# EasyEDA Pro project Schematic1.epro

# Schematic Schematic1
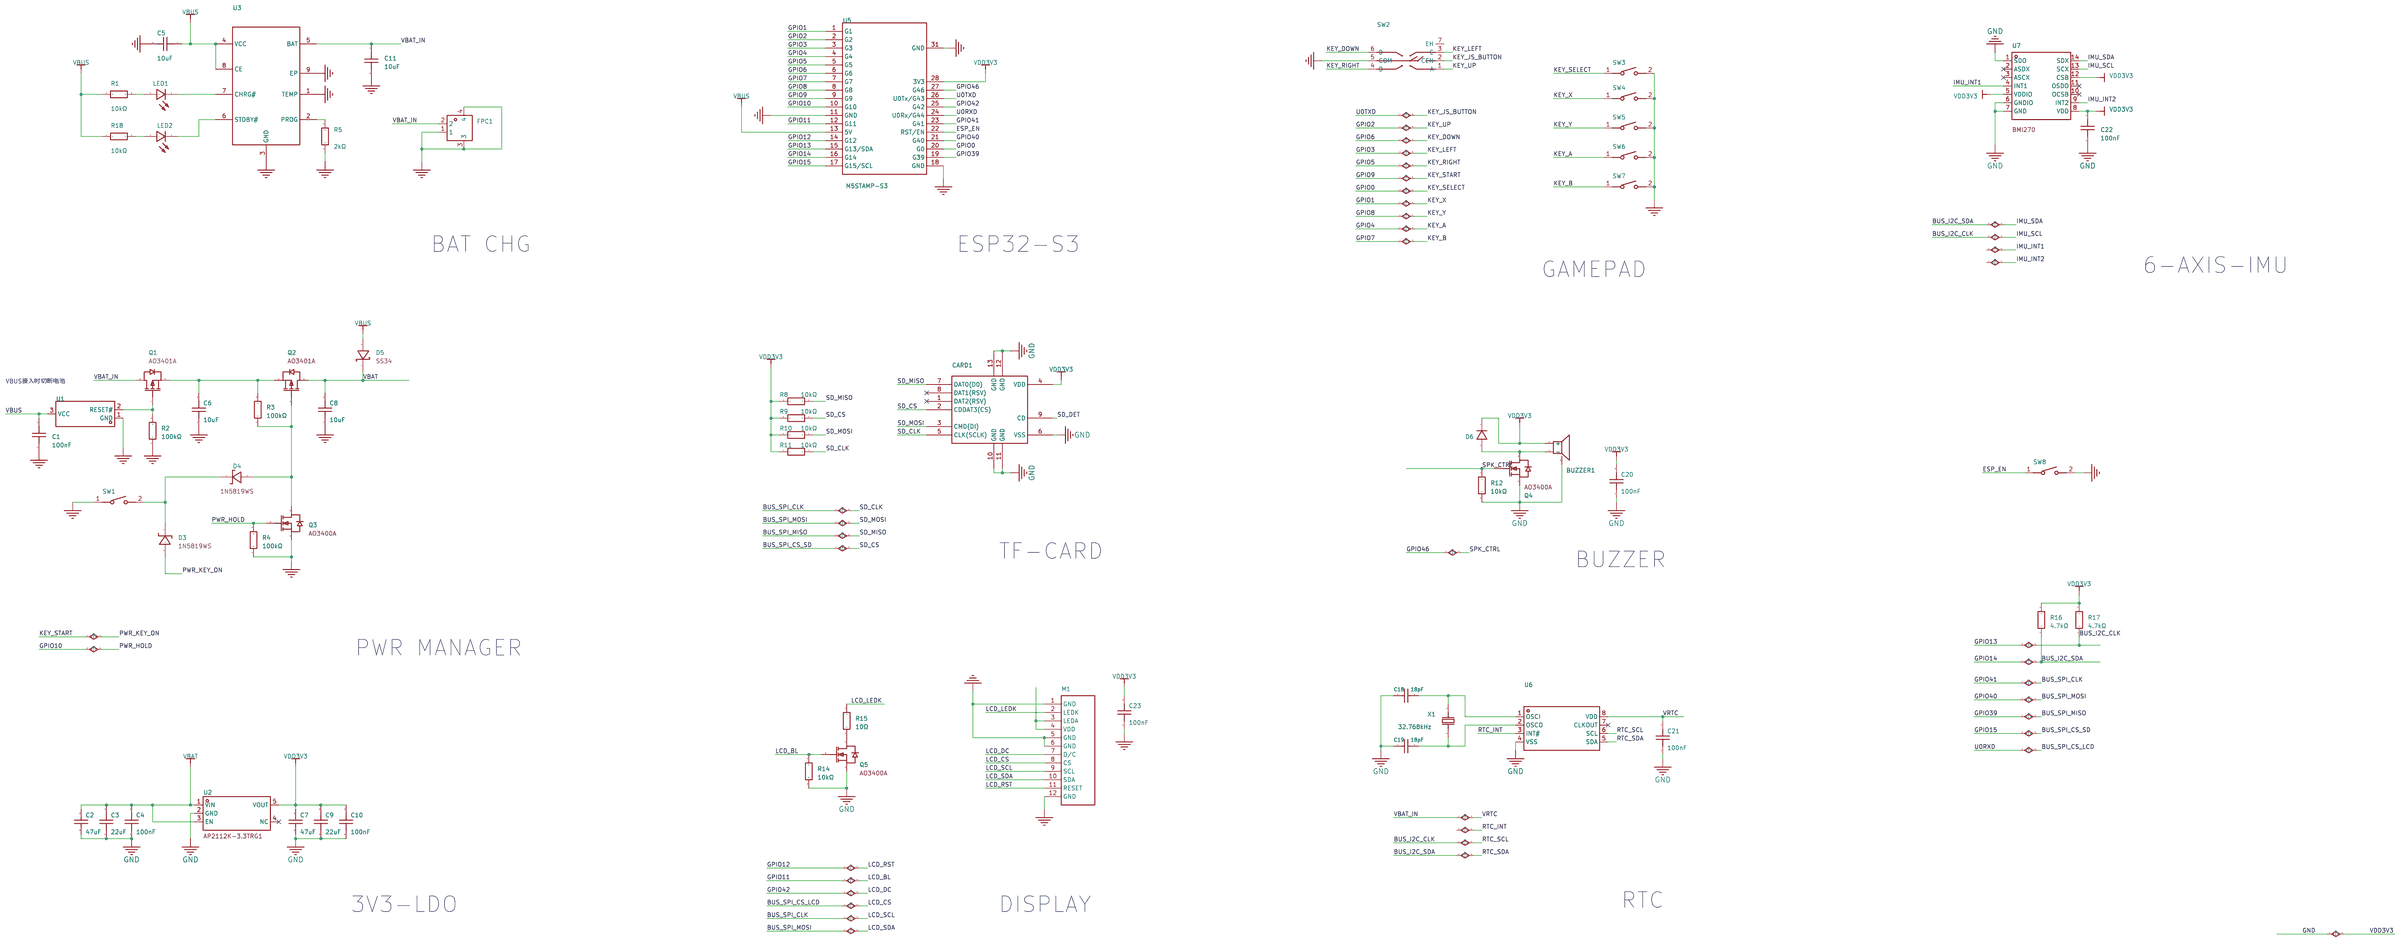
[diagram p0: schematic sheet]

## Parts
BUZZER1  4000Hz  [BUZ-SMD_L5.0-W5.5-P4.60]
C1  100nF  [C0603]
C2  47uF  [C0805]
C3  22uF  [C0805]
C4  100nF  [C0603]
C5  10uF  [C0603]
C6  10uF  [C0603]
C7  47uF  [C0805]
C8  10uF  [C0603]
C9  22uF  [C0805]
C10  100nF  [C0603]
C11  10uF  [C0603]
C18  18pF  [C0603]
C19  18pF  [C0603]
C20  100nF  [C0603]
C21  100nF  [C0603]
C22  100nF  [C0603]
C23  100nF  [C0603]
CARD1  -  [TF-SMD_TF-01A]
D3  1N5819WS  [SOD-323_L1.8-W1.3-LS2.5-RD]
D4  1N5819WS  [SOD-323_L1.8-W1.3-LS2.5-RD]
D5  SS34  [SMA_L4.3-W2.6-LS5.2-RD]
D6  1N4148WS  [SOD-323_L1.8-W1.3-LS2.5-RD]
FPC1  1.25-2PWB  [CONN-SMD_2P-P1.25_DEALON_1.25-2PWB]
LED1  19-213/Y2C-CQ2R2L/3T(CY)  [LED0603-RD-YELLOW]
LED2  19-217/GHC-YR1S2/3T  [LED0603-RD]
M1  1.3寸TFT240*240  [1.3寸TFT240_240]
Q1  AO3401A  [SOT-23_L2.9-W1.3-P1.90-LS2.4-BR]
Q2  AO3401A  [SOT-23_L2.9-W1.3-P1.90-LS2.4-BR]
Q3  AO3400A  [sot-23_l2.9-w1.3-p1.90-ls2.4-br]
Q4  AO3400A  [sot-23_l2.9-w1.3-p1.90-ls2.4-br]
Q5  AO3400A  [sot-23_l2.9-w1.3-p1.90-ls2.4-br]
R1  10kΩ  [R0603]
R2  100kΩ  [R0603]
R3  100kΩ  [R0603]
R4  100kΩ  [R0603]
R5  2kΩ  [R0603]
R8  10kΩ  [R0603]
R9  10kΩ  [R0603]
R10  10kΩ  [R0603]
R11  10kΩ  [R0603]
R12  10kΩ  [R0603]
R14  10kΩ  [R0603]
R15  10Ω  [R0603]
R16  4.7kΩ  [R0603]
R17  4.7kΩ  [R0603]
R18  10kΩ  [R0603]
SW1  TS-1088-AR02016  [SW-SMD_L3.9-W3.0-P4.45]
SW2  TM-4175-B-A  [SW-SMD_TM-4175-B-X]
SW3  TS-1088-AR02016  [SW-SMD_L3.9-W3.0-P4.45]
SW4  TS-1088-AR02016  [SW-SMD_L3.9-W3.0-P4.45]
SW5  TS-1088-AR02016  [SW-SMD_L3.9-W3.0-P4.45]
SW6  TS-1088-AR02016  [SW-SMD_L3.9-W3.0-P4.45]
SW7  TS-1088-AR02016  [SW-SMD_L3.9-W3.0-P4.45]
SW8  TS-1088-AR02016  [SW-SMD_L3.9-W3.0-P4.45]
U1  CN809J  [SOT-23-3_L2.9-W1.3-P1.90-LS2.4-BR]
U2  AP2112K-3.3TRG1  [SOT-25-5_L3.0-W1.8-P0.95-LS3.0-BR]
U3  TP4056-42-ESOP8  [ESOP-8_L4.9-W3.9-P1.27-LS6.0-BL-EP]
U5  M5STAMP-S3  [STAMP-S3-PIN-SMD]
U6  PCF8563T/5,518  [SOIC-8_L5.0-W4.0-P1.27-LS6.0-BL]
U7  BMI270  [LGA-14_L3.0-W2.5-P0.50-BR]
X1  32.768kHz  [FC-135R_L3.2-W1.5]

## Library data of the parts
BUZZER1 = MLT-5020: 驱动方式:无源(外部驱动);构造类型:电磁式;频率:4000Hz;长度:5.2mm;宽度:5.2mm;高度:2.5mm;; Supplier Part: C94598; Manufacturer: 华能; Supplier Footprint: SMD,5x5mm; JLCPCB Part Class: 扩展库; Datasheet: https://atta.szlcsc.com/upload/public/pdf/source/20210811/111454390007D221D7259018FB170E62.pdf; Supplier: LCSC; Oscillator Circuit: 无源(外部驱动); Technology Type: 电磁式; Length: 5.2mm; Width: 5.2mm; Height: 2.5mm
C1 C4 C10 C20-C23 = CC0603KRX7R9BB104: 容值:100nF;精度:±10%;额定电压:50V;材质(温度系数):X7R;; LCSC Part Name: 100nF ±10% 50V; Supplier Part: C14663; Manufacturer: YAGEO(国巨); Supplier Footprint: 0603; JLCPCB Part Class: 基础库; Datasheet: https://atta.szlcsc.com/upload/public/pdf/source/20180910/C282072_33301C7F631E79921B82A8DAC6BCC5B3.pdf; Supplier: LCSC; Tolerance: ±10%; Voltage Rated: 50V; Temperature Coefficient: X7R
C2 C7 = CL21A476MQYNNNE: 容值:47uF;精度:±20%;额定电压:6.3V;材质(温度系数):X5R;; LCSC Part Name: 47uF ±20% 6.3V; Supplier Part: C16780; Manufacturer: SAMSUNG(三星); Supplier Footprint: 0805; JLCPCB Part Class: 基础库; Datasheet: https://atta.szlcsc.com/upload/public/pdf/source/20160103/1457707690276.pdf; Supplier: LCSC; Tolerance: ±20%; Voltage Rated: 6.3V; Temperature Coefficient: X5R
C3 C9 = CL21A226MAQNNNE_C45783: 容值:22uF;精度:±20%;额定电压:25V;材质(温度系数):X5R;; LCSC Part Name: 22uF ±20% 25V; Supplier Part: C45783; Manufacturer: SAMSUNG(三星); Manufacturer Part: CL21A226MAQNNNE; Supplier Footprint: 0805; JLCPCB Part Class: 基础库; Datasheet: https://atta.szlcsc.com/upload/public/pdf/source/20160103/1457707727161.pdf; Supplier: LCSC; Tolerance: ±20%; Voltage Rated: 25V; Temperature Coefficient: X5R
C5 C6 C8 C11 = CL10A106KP8NNNC: 容值:10uF;精度:±10%;额定电压:10V;材质(温度系数):X5R;; LCSC Part Name: 10uF ±10% 10V; Supplier Part: C19702; Manufacturer: SAMSUNG(三星); Supplier Footprint: 0603; JLCPCB Part Class: 基础库; Datasheet: https://atta.szlcsc.com/upload/public/pdf/source/20160103/1457707703378.pdf; Supplier: LCSC; Tolerance: ±10%; Voltage Rated: 10V; Temperature Coefficient: X5R
C18 C19 = CL10C180JB8NNNC: 温度系数:C0G;容值:18pF;精度:±5%;额定电压:50V;; LCSC Part Name: 18pF(180) ±5% 50V; Supplier Part: C1647; Manufacturer: SAMSUNG(三星); Supplier Footprint: 0603; JLCPCB Part Class: 基础库; Supplier: LCSC; Temperature Coefficient: C0G; Tolerance: ±5%; Voltage Rated: 50V
CARD1 = TF-01A: 卡连接方式:自弹式;卡类型:MicroSD卡(TF卡);连接器类型:卡座;本体最大高度:-;触头材质:-;触头镀层:-;工作温度范围:-;焊接温度(最大值):-;; LCSC Part Name: 自弹式 MicroSD卡(TF卡) 卡座; Supplier Part: C91145; Manufacturer: 韩国韩荣; Supplier Footprint: SMD; JLCPCB Part Class: Extended Part; Datasheet: https://atta.szlcsc.com/upload/public/pdf/source/20190322/C91145_63CBD6FB4639A3A3EC6A9721F18AE0FB.pdf; Supplier: LCSC; Card Connection Mode: 自弹式; Card Type: MicroSD卡(TF卡); Connector Type: 卡座
D3 D4 = 1N5819WS_C191023: 直流反向耐压(Vr):40V;平均整流电流(Io):1A;正向压降(Vf):600mV@1A;; LCSC Part Name: 40V 1A 600mV@1A; Supplier Part: C191023; Manufacturer: Hottech(合科泰); Supplier Footprint: SOD-323; JLCPCB Part Class: 基础库; Datasheet: https://atta.szlcsc.com/upload/public/pdf/source/20220428/3CB86FD8D28D653594B4E35F9D5AEFD9.pdf; Supplier: LCSC; Reverse Voltage (Vr): 40V; Average Rectified Current (Io): 1A; Forward Voltage (Vf@If): 600mV@1A
D5 = SS34_C8678: 二极管配置:独立式;直流反向耐压(Vr):40V;平均整流电流(Io):3A;正向压降(Vf):550mV@3A;; LCSC Part Name: 40V 3A 550mV@3A; Supplier Part: C8678; Manufacturer: MDD; Supplier Footprint: SMA(DO-214AC); JLCPCB Part Class: 基础库; Datasheet: https://atta.szlcsc.com/upload/public/pdf/source/20230314/A80AE34493C69B89E2F4B1712F433538.pdf; Supplier: LCSC; Diode Configuration: 独立式; Reverse Voltage (Vr): 40V; Average Rectified Current (Io): 3A; Forward Voltage (Vf@If): 550mV@3A; Reverse Leakage Current (Ir): 500uA@40V
D6 = 1N4148WS_C2128: 二极管配置:独立式;功率:200mW;直流反向耐压(Vr):100V;平均整流电流(Io):150mA;正向压降(Vf):1.25V@150mA;反向电流(Ir):1uA@75V;反向恢复时间(trr):4ns;工作温度:+150℃@(Tj);; LCSC Part Name: 100V 150mA 4ns T4; Supplier Part: C2128; Manufacturer: CJ(江苏长电/长晶); Supplier Footprint: SOD-323; JLCPCB Part Class: 基础库; Datasheet: https://atta.szlcsc.com/upload/public/pdf/source/20140809/1457707208178.pdf; Supplier: LCSC; Diode Configuration: 独立式; Power Dissipation: 200mW; Reverse Voltage (Vr): 100V; Average Rectified Current (Io): 150mA; Forward Voltage (Vf@If): 1.25V@150mA; Reverse Leakage Current: 1uA@75V; Reverse Recovery Time (trr): 4ns; Operating Temperature: +150℃@(Tj)
FPC1 = 1.25-2PWB: 参考系列:-;间距:1.25mm;插针结构:1x2P;排数:1;每排PIN数:2;行距:-;公母:公型插针;安装方式:卧贴;额定电流:-;工作温度范围:-40℃~+85℃;; LCSC Part Name: 1.25mm 1x2P 卧贴; Supplier Part: C2905009; Manufacturer: DEALON(德艺隆); Supplier Footprint: SMD,P=1.25mm; JLCPCB Part Class: 扩展库; Datasheet: https://atta.szlcsc.com/upload/public/pdf/source/20211025/32B11FCE5054D08D2841E43E3DE676AA.pdf; Supplier: LCSC; Pitch: 1.25mm; Pins Structure: 1x2P; Number of Rows: 1; Number of PINs Per Row: 2; Gender: 公型插针; Mounting Style: 卧贴; Operating Temperature Range: -40℃~+85℃
LED1 = 19-213/Y2C-CQ2R2L/3T(CY): 发光颜色:黄灯;二极管配置:-;主波长:585.5nm~591.5nm;色温:-;功率:60mW;安装方式:-;; LCSC Part Name: 黄灯; Supplier Part: C72038; Manufacturer: EVERLIGHT(亿光); Supplier Footprint: 0603; JLCPCB Part Class: 基础库; Datasheet: https://atta.szlcsc.com/upload/public/pdf/source/20160507/1462613613586.pdf; Supplier: LCSC; Emitted Color: 黄灯; Lens Color: 无色透明; Dominant Wavelength: 585.5nm~591.5nm; Peak Wavelength: 591nm; Forward Current: 20mA; Power Dissipation: 60mW; Viewing Angle: 120°; Operating Temperature: -40℃~+85℃
LED2 = 19-217/GHC-YR1S2/3T: 发光颜色:翠绿;二极管配置:-;透镜颜色:无色透明;主波长:520nm~535nm;色温:-;发光强度:199mcd;功率:110mW;发光角度:120°;安装方式:-;工作温度:-40℃~+85℃;; LCSC Part Name: 翠绿; Supplier Part: C72043; Manufacturer: EVERLIGHT(亿光); Supplier Footprint: 0603; JLCPCB Part Class: 基础库; Datasheet: https://atta.szlcsc.com/upload/public/pdf/source/20160507/1462613613780.pdf; Supplier: LCSC; Emitted Color: 翠绿; Lens Color: 无色透明; Dominant Wavelength: 520nm~535nm; Peak Wavelength: 518nm; Forward Current: 20mA; Forward Voltage (VF): 3.3V; Luminous Intensity: 199mcd; Power Dissipation: 110mW; Viewing Angle: 120°; Operating Temperature: -40℃~+85℃
M1 = 1.3寸TFT240*240
Q1 Q2 = AO3401A_C15127: 类型:P沟道;漏源电压(Vdss):30V;连续漏极电流(Id):4A;功率(Pd):1.4W;导通电阻(RDS(on)@Vgs,Id):44mΩ@10V,4.3A;; LCSC Part Name: P沟道 30V 4A; Supplier Part: C15127; Manufacturer: AOS; Supplier Footprint: SOT-23-3L; JLCPCB Part Class: 基础库; Datasheet: https://atta.szlcsc.com/upload/public/pdf/source/20160507/1462613609053.pdf; Supplier: LCSC; Type: P沟道; Drain Source Voltage (Vdss): 30V; Continuous Drain Current (Id): 4A; Power Dissipation (Pd): 1.4W; Drain Source On Resistance (RDS(on)@Vgs,Id): 44mΩ@10V,4.3A; Gate Threshold Voltage (Vgs(th)@Id): 1.3V@250uA
Q3-Q5 = AO3400A_C20917: 类型:N沟道;漏源电压(Vdss):30V;连续漏极电流(Id):5.7A;功率(Pd):1.4W;导通电阻(RDS(on)@Vgs,Id):26.5mΩ@10V,5.7A;; LCSC Part Name: N沟道 30V 5.7A; Supplier Part: C20917; Manufacturer: AOS; Supplier Footprint: SOT-23-3L; JLCPCB Part Class: 基础库; Datasheet: https://atta.szlcsc.com/upload/public/pdf/source/20140107/1457706668533.pdf; Supplier: LCSC; Type: N沟道; Drain Source Voltage (Vdss): 30V; Continuous Drain Current (Id): 5.7A; Power Dissipation (Pd): 1.4W; Drain Source On Resistance (RDS(on)@Vgs,Id): 26.5mΩ@10V,5.7A; Gate Threshold Voltage (Vgs(th)@Id): 1.5V@250uA
R1 R8-R12 R14 R18 = 0603WAF1002T5E: 电阻类型:厚膜电阻;阻值:10kΩ;精度:±1%;功率:100mW;; LCSC Part Name: 厚膜电阻 10kΩ ±1% 100mW; Supplier Part: C25804; Manufacturer: UNI-ROYAL(厚声); Supplier Footprint: 0603; JLCPCB Part Class: 基础库; Datasheet: https://atta.szlcsc.com/upload/public/pdf/source/20200306/C422600_1E6D84923E4A46A82E41ADD87F860B5C.pdf; Supplier: LCSC; Type: 厚膜电阻; Tolerance: ±1%; Power(Watts): 100mW; Temperature Coefficient: ±100ppm/℃; Overload Voltage (Max): 75V; Operating Temperature Range: -55℃~+155℃
R2-R4 = 0603WAF1003T5E: 电阻类型:厚膜电阻;阻值:100kΩ;精度:±1%;功率:100mW;; LCSC Part Name: 100kΩ ±1% 100mW; Supplier Part: C25803; Manufacturer: UNI-ROYAL(厚声); Supplier Footprint: 0603; JLCPCB Part Class: 基础库; Datasheet: https://atta.szlcsc.com/upload/public/pdf/source/20200306/C422600_1E6D84923E4A46A82E41ADD87F860B5C.pdf; Supplier: LCSC; Type: 厚膜电阻; Tolerance: ±1%; Power(Watts): 100mW; Temperature Coefficient: ±100ppm/℃; Overload Voltage (Max): 75V; Operating Temperature Range: -55℃~+155℃
R5 = 0603WAF2001T5E: 电阻类型:厚膜电阻;阻值:2kΩ;精度:±1%;功率:100mW;; LCSC Part Name: 2kΩ ±1% 100mW; Supplier Part: C22975; Manufacturer: UNI-ROYAL(厚声); Supplier Footprint: 0603; JLCPCB Part Class: 基础库; Datasheet: https://atta.szlcsc.com/upload/public/pdf/source/20200306/C422600_1E6D84923E4A46A82E41ADD87F860B5C.pdf; Supplier: LCSC; Type: 厚膜电阻; Tolerance: ±1%; Power(Watts): 100mW; Temperature Coefficient: ±100ppm/℃; Overload Voltage (Max): 75V; Operating Temperature Range: -55℃~+155℃
R15 = 0603WAF100JT5E: 电阻类型:厚膜电阻;阻值:10Ω;精度:±1%;功率:100mW;温度系数:±400ppm/℃;最大工作电压:75V;工作温度范围:-55℃~+155℃;; LCSC Part Name: 10Ω ±1% 100mW; Supplier Part: C22859; Manufacturer: UNI-ROYAL(厚声); Supplier Footprint: 0603; JLCPCB Part Class: 基础库; Datasheet: https://atta.szlcsc.com/upload/public/pdf/source/20200306/C422600_1E6D84923E4A46A82E41ADD87F860B5C.pdf; Supplier: LCSC; Type: 厚膜电阻; Tolerance: ±1%; Power(Watts): 100mW; Temperature Coefficient: ±400ppm/℃; Overload Voltage (Max): 75V; Operating Temperature Range: -55℃~+155℃
R16 R17 = 0603WAF4701T5E: 电阻类型:厚膜电阻;阻值:4.7kΩ;精度:±1%;功率:100mW;; LCSC Part Name: 4.7kΩ ±1% 100mW; Supplier Part: C23162; Manufacturer: UNI-ROYAL(厚声); Supplier Footprint: 0603; JLCPCB Part Class: 基础库; Datasheet: https://atta.szlcsc.com/upload/public/pdf/source/20200306/C422600_1E6D84923E4A46A82E41ADD87F860B5C.pdf; Supplier: LCSC; Type: 厚膜电阻; Tolerance: ±1%; Power(Watts): 100mW; Temperature Coefficient: ±100ppm/℃; Overload Voltage (Max): 75V; Operating Temperature Range: -55℃~+155℃
SW1 SW3-SW8 = TS-1088-AR02016: 触点电流:50mA;额定电压(DC):12V;绝缘电阻:100MΩ;电路结构:单刀单掷;安装方式:立贴;作用力:160gf@±50gf;机械寿命:10万次;带支架:否;; LCSC Part Name: 4*3*2mm 立贴 轻触开关; Supplier Part: C720477; Manufacturer: XUNPU(讯普); Supplier Footprint: SMD; JLCPCB Part Class: 扩展库; Datasheet: https://atta.szlcsc.com/upload/public/pdf/source/20200810/C720475_60D09DD6C54279ADDB2DC25100F1CC11.pdf; Supplier: LCSC; Contact Current: 50mA; Voltage Rating (DC): 12V; Insulation Resistance: 100MΩ; Circuit: 单刀单掷; Mounting Style: 立贴; Actuator Style: 圆形按钮; Actuator/Cap Color: 黑色; Operating Force: 160gf@±50gf; Mechanical Life: 10万次; Operating Temperature: -30℃~+80℃; Pin Style: SMD接片; Switch Length: 4mm; Switch Width: 3mm; Switch Height: 2mm; Strike Gundam: 否
SW2 = TM-4175-B-A: 多功能开关 7.5*7.5*5 五向开关 H5; LCSC Part Name: 多功能开关 7.5*7.5*5 五向开关 H5; Supplier Part: C465995; Manufacturer: XKB Connectivity(中国星坤); Supplier Footprint: SMD-8P,7.5x7.5mm; JLCPCB Part Class: 扩展库; Datasheet: https://atta.szlcsc.com/upload/public/pdf/source/20211011/A0F6117F2AB0E02F6CF3847B7456F266.pdf; Supplier: LCSC
U1 = CN809J: 电源管理芯片的类型:-;监控的组数:-;输出端类型:-;有效的复位电平:-;复位阀值电压:-;; Supplier Part: C840516; Manufacturer: CONSONANCE(上海如韵); Supplier Footprint: SOT-23-3; JLCPCB Part Class: 扩展库; Datasheet: https://atta.szlcsc.com/upload/public/pdf/source/20200918/C840515_7DFC99A23260E65C6304EE619FD5F333.pdf; Supplier: LCSC
U2 = AP2112K-3.3TRG1: 输出类型:固定;输出极性:正;输出通道数:1;最大输入电压:6V;输出电压:3.3V;压差:400mV@(600mA);输出电流:600mA;电源纹波抑制比(PSRR):65dB@(100Hz,1kHz);; LCSC Part Name: 正 Vin=6V Vout=3.3V 600mA 65dB@(100Hz,1kHz); Supplier Part: C51118; Manufacturer: DIODES(美台); Supplier Footprint: SOT-25; JLCPCB Part Class: 扩展库; Datasheet: https://atta.szlcsc.com/upload/public/pdf/source/20171221/C51118_15138312998391195590.pdf; Supplier: LCSC; Output Type: 固定; Output Polarity: 正; Number of Outputs: 1; Maximum Input Voltage: 6V; Output Voltage: 3.3V; Dropout Voltage: 400mV@(600mA); Output Current: 600mA; Power Supply Rejection Ratio (PSRR): 65dB@(100Hz,1kHz)
U3 = TP4056-42-ESOP8: 锂电池充电芯片; LCSC Part Name: TP4056-42-ESOP8 编带; Supplier Part: C16581; Manufacturer: TOPPOWER(南京拓微); Supplier Footprint: ESOP-8; JLCPCB Part Class: 基础库; Datasheet: https://atta.szlcsc.com/upload/public/pdf/source/20160713/1468379849914.pdf; Supplier: LCSC
U5 = STAMP-S3-PIN-SMD
U6 = PCF8563T/5,518: 接口:I2C;; LCSC Part Name: I2C 1.8V~5.5V MSL=2; Supplier Part: C7440; Manufacturer: NXP(恩智浦); Supplier Footprint: SOIC-8; JLCPCB Part Class: 基础库; Datasheet: https://atta.szlcsc.com/upload/public/pdf/source/20140505/1457707048733.pdf; Supplier: LCSC; Interface: I2C; Operating Voltage: 1.8V~5.5V
U7 = BMI270: IMU-惯性测量单元; Supplier Part: C2836813; Manufacturer: Bosch(博世); Supplier Footprint: LGA-14(2.5x3); JLCPCB Part Class: 扩展库; Datasheet: https://atta.szlcsc.com/upload/public/pdf/source/20210625/C2836813_35E1F3F92097F45A3828DF13DDBA01A5.pdf; Supplier: LCSC
X1 = Q13FC1350000400: 晶振类型:贴片无源晶振;频率:32.768kHz;频率公差:±20ppm;负载电容:12.5pF;等效串联电阻(ESR):70kΩ;工作温度:-40℃~+85℃;; LCSC Part Name: 32.768kHz ±20ppm 12.5pF; Supplier Part: C32346; Manufacturer: EPSON(爱普生); Supplier Footprint: SMD3215-2P; JLCPCB Part Class: 基础库; Datasheet: https://atta.szlcsc.com/upload/public/pdf/source/20190108/C32346_746D6B07EAF90824457A96480007685F.pdf; Supplier: LCSC; Crystal Type: 贴片无源晶振; Frequency Tolerance: ±20ppm; Load Capacitance: 12.5pF; Equivalent Series Resistance (ESR): 70kΩ; Operating Temperature: -40℃~+85℃

## Nets
GND: BUZZER1.1(+) BUZZER1.3(NC) C1.1 C2.1 C3.1 C4.1 C5.2 C6.1 C7.1 C7.2 C8.1 C9.1 C9.2 C10.1 C10.2 C11.1 C18.1 C19.1 C20.1 C20.2 C21.1 C22.1 C22.2 C23.1 C23.2 CARD1.4(VDD) CARD1.6(VSS) CARD1.10(GND) CARD1.11(GND) CARD1.12(GND) CARD1.13(GND) D6.1(K) FPC1.1 FPC1.3 FPC1.4 M1.1(GND) M1.3(LEDA) M1.4(VDD) M1.5(GND) M1.6(GND) M1.12(GND) Q3.2(S) Q4.2(S) Q5.2(S) R2.1 R4.1 R5.1 R8.2 R9.2 R10.2 R11.2 R12.2 R14.2 R16.2 R17.2 SW1.1 SW2.5(COM) SW3.2 SW4.2 SW5.2 SW6.2 SW7.2 SW8.2 U1.1(GND) U2.2(GND) U2.5(VOUT) U3.1(TEMP) U3.3(GND) U3.9(EP) U5.11(GND) U5.18(GND) U5.28(3V3) U5.31(GND) U6.4(VSS) U7.1(SDO) U7.5(VDDIO) U7.6(GNDIO) U7.7(GND) U7.8(VDD) U7.12(CSB)
VBAT: C2.2 C3.2 C4.2 C8.2 D5.1(K) Q2.3(D) U2.1(VIN) U2.3(EN)
VBAT_IN: C11.2 C21.2 FPC1.2 Q1.3(D) U3.5(BAT) U6.8(VDD)
VBUS: C1.2 C5.1 D5.2(A) R1.1 R18.1 U1.3(VCC) U3.4(VCC) U3.8(CE) U5.13(5V)
BUS_I2C_CLK: R17.1 U5.15(G13/SDA) U6.6(SCL) U7.13(SCX)
BUS_I2C_SDA: R16.1 U5.16(G14) U6.5(SDA) U7.14(SDX)
BUS_SPI_CLK: CARD1.5(CLK(SCLK)) M1.9(SCL) R11.1 U5.23(G41)
BUS_SPI_CS_LCD: M1.8(CS) U5.24(U0Rx/G44)
BUS_SPI_CS_SD: CARD1.2(CDDAT3(CS)) R9.1 U5.17(G15/SCL)
BUS_SPI_MISO: CARD1.7(DAT0(D0)) R8.1 U5.19(G39)
BUS_SPI_MOSI: CARD1.3(CMD(DI)) M1.10(SDA) R10.1 U5.21(G40)
ESP_EN: SW8.1 U5.22(RST/EN)
GPIO0: SW3.1 U5.20(G0)
GPIO1: SW4.1 U5.1(G1)
GPIO2: SW2.1(A) U5.2(G2)
GPIO3: SW2.3(C) U5.3(G3)
GPIO4: SW6.1 U5.4(G4)
GPIO5: SW2.4(B) U5.5(G5)
GPIO6: SW2.6(D) U5.6(G6)
GPIO7: SW7.1 U5.7(G7)
GPIO8: SW5.1 U5.8(G8)
GPIO9: D3.2(A) U5.9(G9)
GPIO10: Q3.1(G) R4.2 U5.10(G10)
GPIO11: Q5.1(G) R14.1 U5.12(G11)
GPIO12: M1.11(RESET) U5.14(G12)
GPIO42: M1.7(D/C) U5.25(G42)
GPIO46: Q4.1(G) R12.1 U5.27(G46)
IMU_INT1: U7.4(INT1)
IMU_INT2: U7.9(INT2)
KEY_JS_BUTTON: SW2.2(CEN) U5.26(U0Tx/G43)
LCD_LEDK: M1.2(LEDK) R15.2
RTC_INT: U6.3(INT#)
SD_DET: CARD1.9(CD)
Net-(BUZZER1-2): BUZZER1.2(-) D6.2(A) Q4.3(D)
Net-(C6-2): C6.2 Q1.2(S) Q2.2(S) R3.2
Net-(C18-2): C18.2 U6.1(OSCI) X1.1
Net-(C19-2): C19.2 U6.2(OSCO) X1.2
Net-(D3-1): D3.1(C) D4.1(C) SW1.2
Net-(D4-2): D4.2(A) Q2.1(G) Q3.3(D) R3.1
Net-(LED1-1): LED1.1(C) U3.7(CHRG#)
Net-(LED1-2): LED1.2(A) R1.2
Net-(LED2-1): LED2.1(C) U3.6(STDBY#)
Net-(LED2-2): LED2.2(A) R18.2
Net-(Q1-1): Q1.1(G) R2.2 U1.2(RESET#)
Net-(Q5-3): Q5.3(D) R15.1
Net-(R5-2): R5.2 U3.2(PROG)

Not connected (* = marked no-connect by the designer): CARD1 1(DAT2(RSV))* 8(DAT1(RSV))*; SW2 7(EH); U2 4(NC)*; U6 7(CLKOUT)*; U7 2(ASDX)* 3(ASCX)* 10(OCSB)* 11(OSDO)*

## Notes on the sheet
- BAT CHG
- ESP32-S3
- 6-AXIS-IMU
- GAMEPAD
- VBUS接入时切断电池
- TF-CARD
- BUZZER
- PWR MANAGER
- RTC
- 3V3-LDO
- DISPLAY
